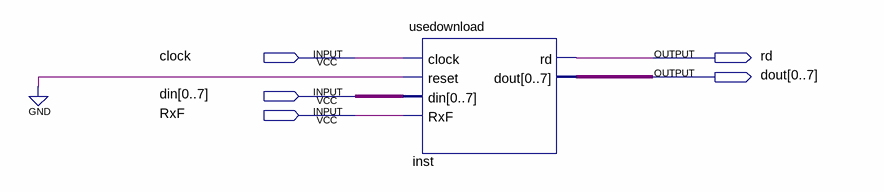
[diagram p0: schematic sheet]
// Quartus schematic usedownload.bdf as structural Verilog: 1 symbols, 5 pins
module usedownload (
  input  clock,
  input  [0:7] din,
  input  RxF,
  output rd,
  output [0:7] dout
);

  usedownload inst (.clock(clock), .reset(1'b0), .din(din), .RxF(RxF), .rd(rd), .dout(dout));
endmodule
